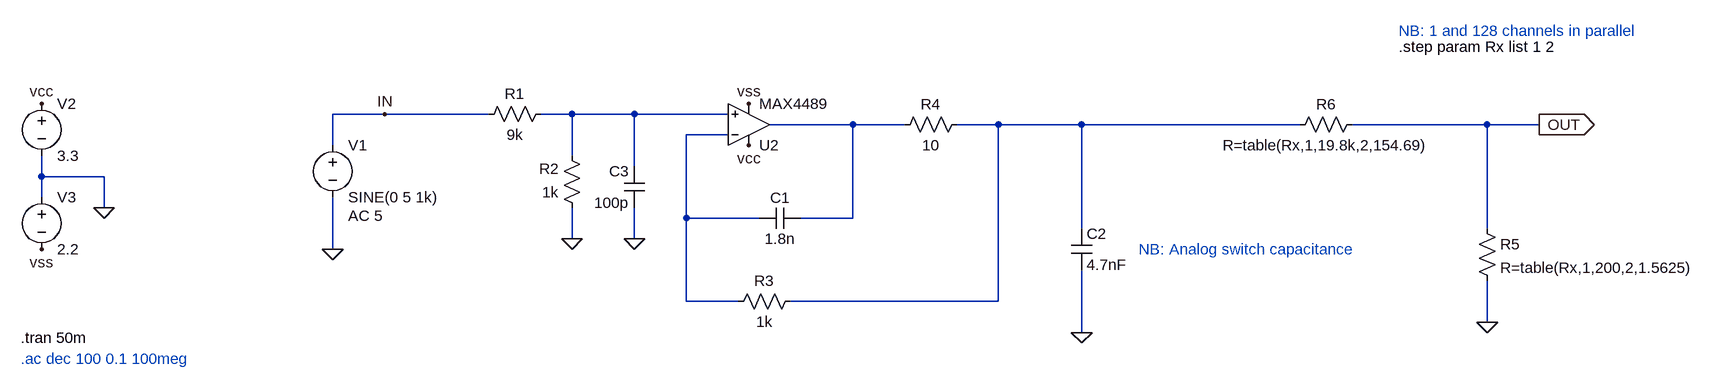
[diagram p0: schematic ext-input.asc]
ext-input.asc, the LTspice schematic file:
Version 4.1
SHEET 1 1612 680
WIRE -448 160 -528 160
WIRE -288 160 -448 160
WIRE -160 160 -208 160
WIRE -64 160 -160 160
WIRE 80 160 -64 160
WIRE 272 176 144 176
WIRE 352 176 272 176
WIRE 496 176 432 176
WIRE 624 176 496 176
WIRE 960 176 624 176
WIRE 1248 176 1040 176
WIRE 1328 176 1248 176
WIRE 80 192 16 192
WIRE -528 208 -528 160
WIRE -160 224 -160 160
WIRE -64 240 -64 160
WIRE -976 256 -976 224
WIRE -880 256 -976 256
WIRE -976 288 -976 256
WIRE -880 304 -880 256
WIRE 16 320 16 192
WIRE 128 320 16 320
WIRE 272 320 272 176
WIRE 272 320 192 320
WIRE 624 336 624 176
WIRE 1248 336 1248 176
WIRE -160 352 -160 304
WIRE -64 352 -64 304
WIRE -528 368 -528 288
WIRE 16 448 16 320
WIRE 96 448 16 448
WIRE 496 448 496 176
WIRE 496 448 176 448
WIRE 1248 480 1248 416
WIRE 624 496 624 400
FLAG -528 368 0
FLAG -880 304 0
FLAG -976 368 vss
FLAG -976 144 vcc
FLAG -160 352 0
FLAG 112 144 vss
FLAG 112 208 vcc
FLAG -448 160 IN
FLAG 1248 480 0
FLAG 1328 176 OUT
IOPIN 1328 176 Out
FLAG 624 496 0
FLAG -64 352 0
SYMBOL OpAmps\\MAX4489 112 240 M180
SYMATTR InstName U2
SYMBOL voltage -528 192 R0
WINDOW 123 24 124 Left 2
WINDOW 39 0 0 Left 0
SYMATTR InstName V1
SYMATTR Value SINE(0 5 1k)
SYMATTR Value2 AC 5
SYMBOL res -192 144 R90
WINDOW 0 0 56 VBottom 2
WINDOW 3 32 56 VTop 2
SYMATTR InstName R1
SYMATTR Value 9k
SYMBOL res -144 320 R180
WINDOW 0 36 76 Left 2
WINDOW 3 36 40 Left 2
SYMATTR InstName R2
SYMATTR Value 1k
SYMBOL voltage -976 128 R0
WINDOW 123 0 0 Left 0
WINDOW 39 0 0 Left 0
SYMATTR InstName V2
SYMATTR Value 3.3
SYMBOL voltage -976 272 R0
WINDOW 123 0 0 Left 0
WINDOW 39 0 0 Left 0
SYMATTR InstName V3
SYMATTR Value 2.2
SYMBOL res 192 432 R90
WINDOW 0 0 56 VBottom 2
WINDOW 3 32 56 VTop 2
SYMATTR InstName R3
SYMATTR Value 1k
SYMBOL res 448 160 R90
WINDOW 0 0 56 VBottom 2
WINDOW 3 32 56 VTop 2
SYMATTR InstName R4
SYMATTR Value 10
SYMBOL res 1232 320 R0
SYMATTR InstName R5
SYMATTR Value R=table(Rx,1,200,2,1.5625)
SYMBOL res 1056 160 R90
WINDOW 0 0 56 VBottom 2
WINDOW 3 32 56 VTop 2
SYMATTR InstName R6
SYMATTR Value R=table(Rx,1,19.8k,2,154.69)
SYMBOL cap 608 336 R0
SYMATTR InstName C2
SYMATTR Value 4.7nF
SYMBOL cap 192 304 R90
WINDOW 0 0 32 VBottom 2
WINDOW 3 32 32 VTop 2
SYMATTR InstName C1
SYMATTR Value 1.8n
SYMBOL cap -48 304 R180
WINDOW 0 24 56 Left 2
WINDOW 3 24 8 Left 2
SYMATTR InstName C3
SYMATTR Value 100p
TEXT -1008 504 Left 2 !.tran 50m
TEXT 1112 32 Left 2 ;NB: 1 and 128 channels in parallel
TEXT 1112 56 Left 2 !.step param Rx list 1 2
TEXT 712 368 Left 2 ;NB: Analog switch capacitance
TEXT -1008 536 Left 2 ;.ac dec 100 0.1 100meg

The netlist it stands for:
* ext-input.asc
X§U2 N001 N004 vcc vss N002 MAX4489  ; pins In+ In- V+ V- OUT
V1 IN 0 SINE(0 5 1k) AC 5
R1 N001 IN 9k
R2 0 N001 1k
V2 vcc 0 3.3
V3 0 vss 2.2
R3 N003 N004 1k
R4 N003 N002 10
R5 OUT 0 R=table(Rx,1,200,2,1.5625)
R6 OUT N003 R=table(Rx,1,19.8k,2,154.69)
C2 N003 0 4.7nF
C1 N002 N004 1.8n
C3 0 N001 100p
.tran 50m
* NB: 1 and 128 channels in parallel
.step param Rx list 1 2
* NB: Analog switch capacitance
* .ac dec 100 0.1 100meg
.backanno
.end